# EAGLE design 2in-2out_1.0b (EAGLE 5.02)
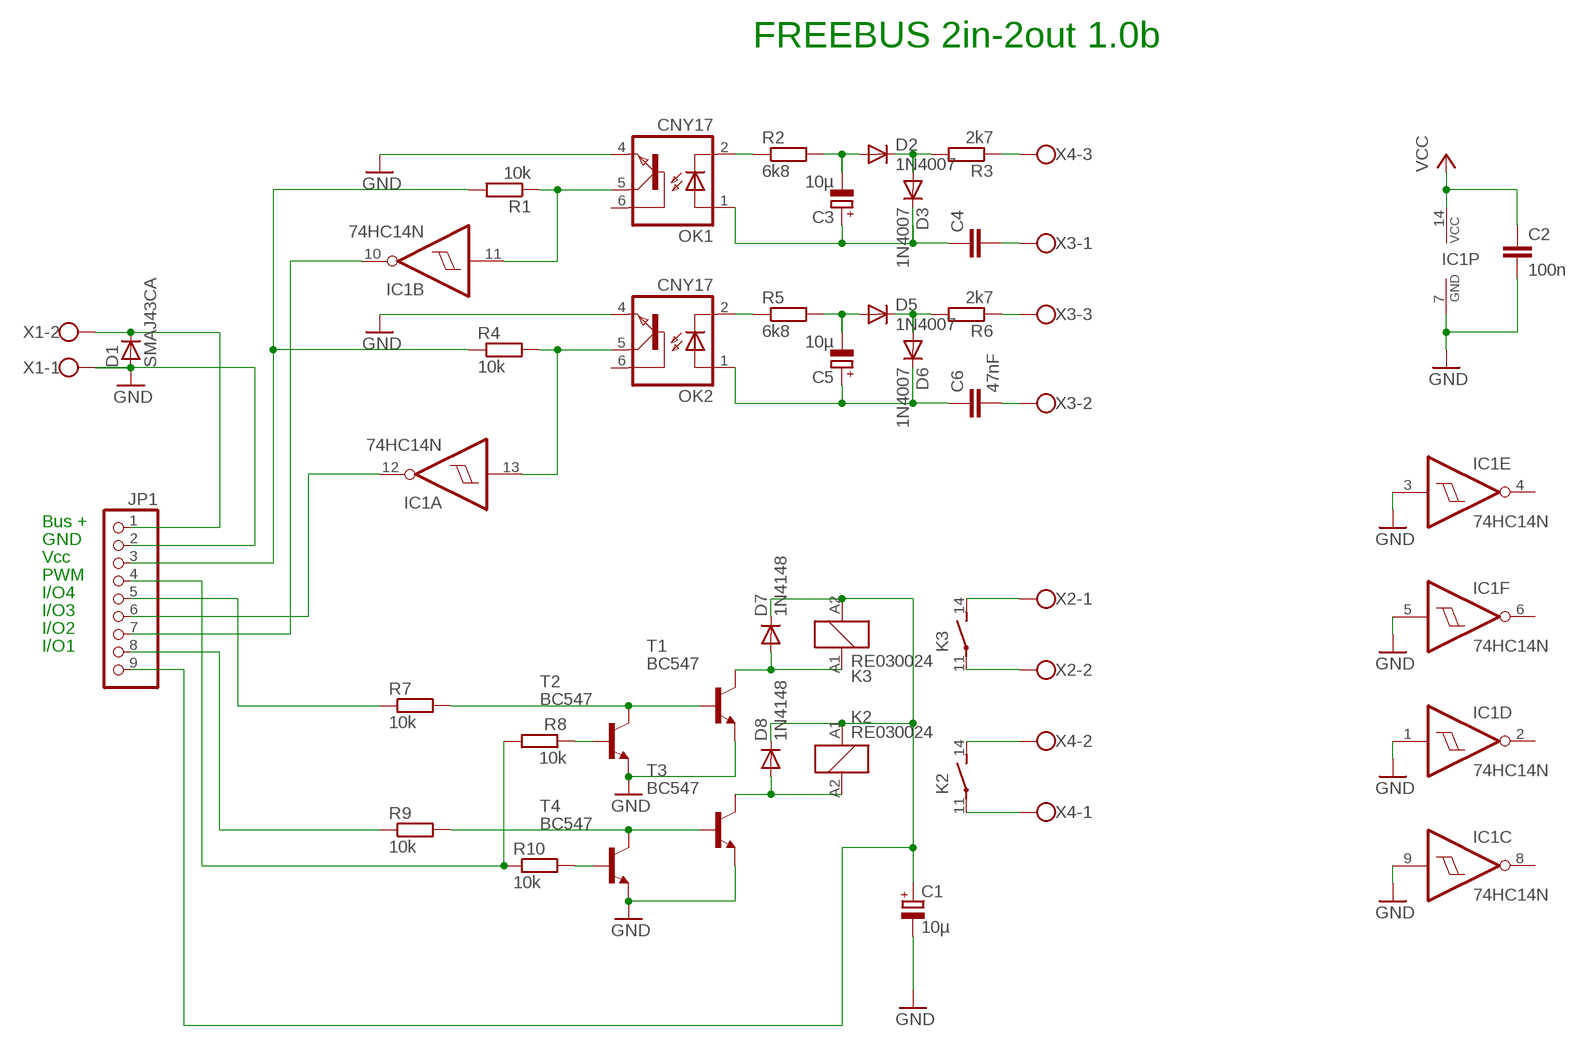
[diagram p0: schematic, sheet 1]

## Parts
C1  10µ  CPOL-EUE3.5-8  [E3,5-8]
C2  100n  C-EU025-024X044  [C025-024X044]
C3  10µ  CPOL-EUE2-4  [E2-4]
C4  C-EU075-063X106  [C075-063X106]
C5  10µ  CPOL-EUE2-4  [E2-4]
C6  47nF  C-EU075-063X106  [C075-063X106]
D1  SMAJ43CA  D-SMB  [SMB]
D2  1N4007  DIODE-D-2.5  [D-2.5]
D3  1N4007  DIODE-D-2.5  [D-2.5]
D5  1N4007  DIODE-D-2.5  [D-2.5]
D6  1N4007  DIODE-D-2.5  [D-2.5]
D7  1N4148  1N4148STEHEND  [D-2.5]
D8  1N4148  1N4148STEHEND  [D-2.5]
IC1  74HC14N  [DIL14]
JP1  PINHD-1X9  [1X09]
K2  RE030024  [RE-SCHRACK]
K3  RE030024  [RE-SCHRACK]
OK1  CNY17  [DIL06]
OK2  CNY17  [DIL06]
R1  10k  R-EU_0207/10  [0207/10]
R2  6k8  R-EU_0207/2V  [0207/2V]
R3  2k7  R-EU_0207/2V  [0207/2V]
R4  10k  R-EU_0207/2V  [0207/2V]
R5  6k8  R-EU_0207/2V  [0207/2V]
R6  2k7  R-EU_0207/2V  [0207/2V]
R7  10k  R-EU_0207/2V  [0207/2V]
R8  10k  R-EU_0207/2V  [0207/2V]
R9  10k  R-EU_0207/2V  [0207/2V]
R10  10k  R-EU_0204/7  [0204/7]
T1  BC547  [TO92]
T2  BC547  [TO92]
T3  BC547  [TO92]
T4  BC547  [TO92]
X1  W237-02P  [W237-132]
X2  W237-02P  [W237-132]
X3  W237-3E  [W237-3E]
X4  W237-3E  [W237-3E]

## Nets
GND: C1.- C2.2 D1.2(A) IC1.1(D:I) IC1.3(E:I) IC1.5(F:I) IC1.7(P:GND) IC1.9(C:I) JP1.2 OK1.4(EMI) OK2.4(EMI) T1.1(E) T2.1(E) T3.1(E) T4.1(E) X1.1
IO1: JP1.8 R9.1
IO2: IC1.10(B:O) JP1.7
IO3: IC1.12(A:O) JP1.6
IO4: JP1.5 R7.1
N$1: OK1.2(C) R2.1
N$2: K3.11(2:P) X2.2
N$3: C3.- D2.A R2.2
N$4: D1.1(C) JP1.1 X1.2
N$5: D2.C D3.A R3.2
N$6: K3.14(2:S) X2.1
N$8: K2.14(2:S) X4.2
N$9: K2.11(2:P) X4.1
N$10: OK2.2(C) R5.1
N$11: R6.1 X3.3
N$13: C5.- D5.A R5.2
N$14: R7.2 T1.2(B) T2.3(C)
N$15: C4.2 X3.1
N$17: R9.2 T3.2(B) T4.3(C)
N$18: D5.C D6.A R6.2
N$19: D8.A K2.A2 T3.3(C)
N$20: C5.+ C6.1 D6.C OK2.1(A)
N$21: R8.1 T2.2(B)
N$22: R10.2 T4.2(B)
N$23: C6.2 X3.2
N$24: C3.+ C4.1 D3.C OK1.1(A)
N$25: R3.1 X4.3
N$28: IC1.13(A:I) OK2.5(COL) R4.2
N$29: IC1.11(B:I) OK1.5(COL) R1.1
PWM: JP1.4 R8.2 R10.1
R3: D7.A K3.A1 T1.3(C)
VCC: C2.1 IC1.14(P:VCC) JP1.3 R1.2 R4.1
VDD_IN: C1.+ D7.C D8.C JP1.9 K2.A1 K3.A2
Unconnected: IC1.2(D:O) IC1.4(E:O) IC1.6(F:O) IC1.8(C:O) OK1.6(BAS) OK2.6(BAS)

## Notes on the sheet
- FREEBUS 2in-2out 1.0b
- Bus +
- GND
- Vcc
- PWM
- I/O4
- I/O3
- I/O2
- I/O1

## Library data of the parts
C1 C3 C5 = rcl:CPOL-EU: POLARIZED CAPACITOR, European symbol
C2 C4 C6 = rcl:C-EU: CAPACITOR, European symbol
D1 = semicon-smd-ipc:D-: DIODE unfilled
D2 D3 D5 D6 = diode:DIODE-: DIODE
D7 D8 = diode:1N4148: DIODE high speed (Philips)
IC1 = 74xx-eu:74*14: Hex schmitt trigger INVERTER
JP1 = pinhead:PINHD-1X9: PIN HEADER
K2 K3 = relay:RE03*: Miniature PCB Relay 1 pole 6 A SCHRACK Source: http://www.schrack.com/.. 5812.pdf
OK1 OK2 = optocoupler:CNY17: SIEMENS OPTO COUPLER
R1-R10 = rcl:R-EU_: RESISTOR, European symbol
T1-T4 = transistor-npn:BC547*: NPN Transistor
X1 X2 = con-wago-508:W237-02P: WAGO SREW CLAMP
X3 X4 = con-wago-508:W237-3E: WAGO SREW CLAMP

## Board
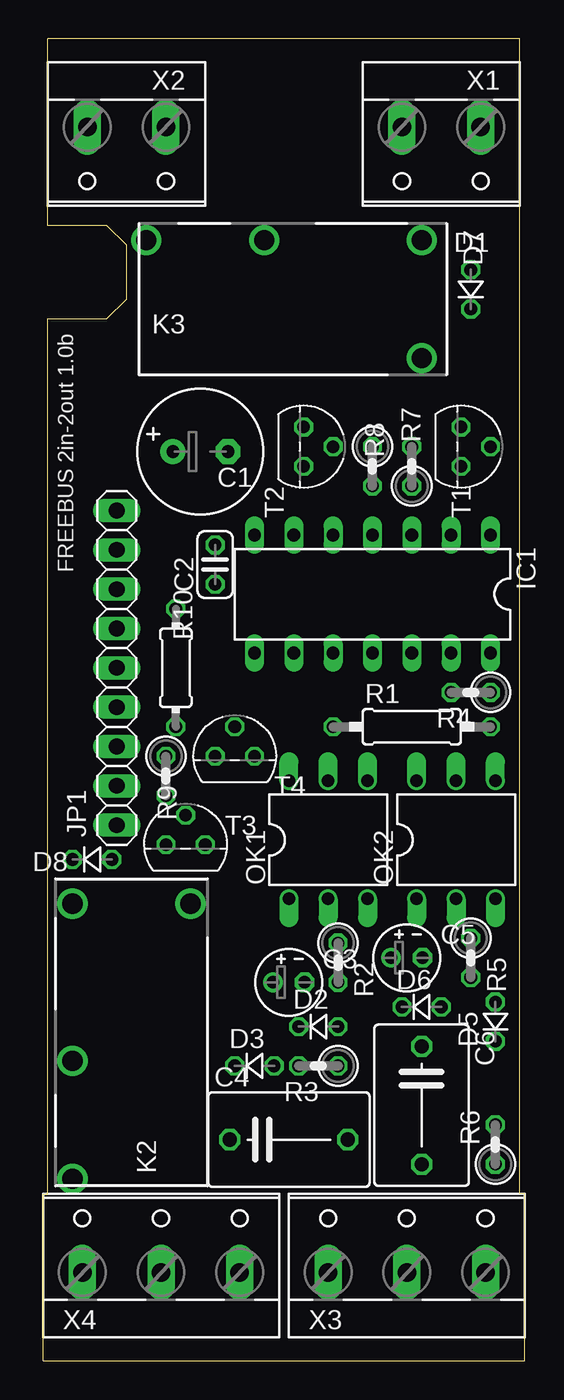
[diagram p1: board, top side]
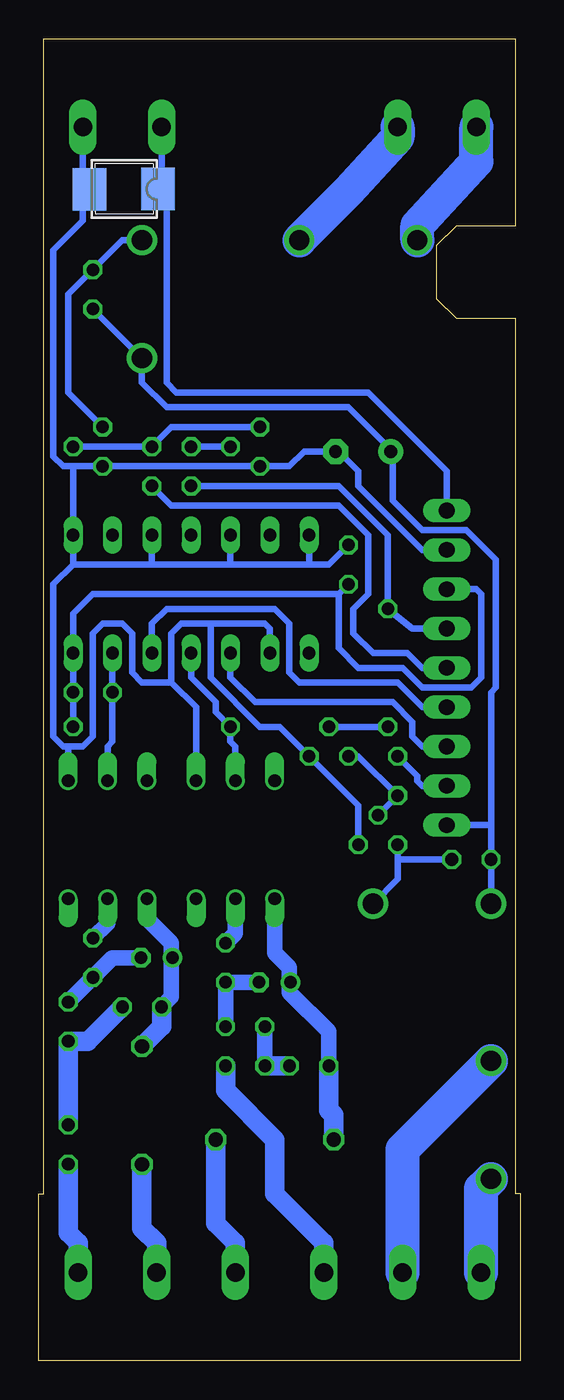
[diagram p2: board, bottom side, seen from below]

Size 31.11 x 85.41 mm. Coordinates in mm from the lower left corner, seen from the top.
Outline: 0,0 0,10.79 0.32,10.79 0.32,67.31 4.13,67.31 5.4,68.58 5.4,72.07 4.13,73.34 0.32,73.34 0.32,85.41 30.8,85.41 30.8,10.79 31.11,10.79 31.11,0 0,0
Copper layers (1*16): Top 0.035mm / dielectric 1.5mm / Bottom 0.035mm
Design rules "ZWILLING": minimum track width 0.2mm, minimum drill 0.5mm, track to track 0.2mm, track to pad 0.2mm, pad to pad 0.2mm, via to via 0.2mm, smd to smd 0mil, copper to edge 0.2mm, drill to drill 0.2mm, minimum pad ring 0.2mm, minimum via ring 0.2mm, stop-mask expansion 0.1mm, vias tented up to drill 0mil, thermal gap 10mil

### Footprints (pad centres in the part's own frame; a part is rotated, then mirrored left to right if it is on the bottom)
E3,5-8 = drill 0.813 pad 1.6 round: + -1.778,0 | drill 0.813 pad 1.6 octagon: - 1.778,0
C025-024X044 = drill 0.813 octagon: 1 -1.27,0; 2 1.27,0
E2-4 = drill 0.813 pad 1.27 round: + -1.016,0 | drill 0.813 pad 1.27 octagon: - 1.016,0
C075-063X106 = drill 0.914 octagon: 1 -3.81,0; 2 3.81,0
SMB = smd 2.159 x 2.743: 1 -2.311,-0.127; 2 2.108,-0.102
D-2.5 = drill 0.813 octagon: A 1.27,0; C -1.27,0
DIL14 = drill 0.813 long: 1 -7.62,-3.81; 2 -5.08,-3.81; 3 -2.54,-3.81; 4 0,-3.81; 5 2.54,-3.81; 6 5.08,-3.81; 7 7.62,-3.81; 8 7.62,3.81; 9 5.08,3.81; 10 2.54,3.81; 11 0,3.81; 12 -2.54,3.81; 13 -5.08,3.81; 14 -7.62,3.81
1X09 = drill 1.016 long: 1 -10.16,0; 2 -7.62,0; 3 -5.08,0; 4 -2.54,0; 5 0,0; 6 2.54,0; 7 5.08,0; 8 7.62,0; 9 10.16,0
RE-SCHRACK = drill 1.3 round: 11 8.89,-3.81; 14 1.27,-3.81; A1 -8.89,-3.81; A2 -8.89,3.81
DIL06 = drill 0.813 offset: 1 -2.54,-3.81; 2 0,-3.81; 3 2.54,-3.81; 4 2.54,3.81; 5 0,3.81; 6 -2.54,3.81
0207/10 = drill 0.813 octagon: 1 -5.08,0; 2 5.08,0
0207/2V = drill 0.813 octagon: 1 -1.27,0; 2 1.27,0
0204/7 = drill 0.813 octagon: 1 -3.81,0; 2 3.81,0
TO92 = drill 0.813 octagon: 1 1.27,0; 2 0,1.905; 3 -1.27,0
W237-132 = drill 1.194 long: 1 -2.54,-0.635; 2 2.54,-0.635
W237-3E = drill 1.194 long: 1 -5.08,-0.635; 2 0,-0.635; 3 5.08,-0.635

### Placement (x,y rotation side)
C1  10.16,58.74 0 top
C2  11.11,51.44 90 top
C3  15.88,24.45 0 top
C4  15.88,14.29 0 top
C5  23.49,26.04 0 top
C6  24.45,16.51 270 top
D1  25.72,75.56 180 bottom
D2  17.78,21.59 0 top
D3  13.65,19.05 0 top
D5  29.21,21.91 90 top
D6  24.45,22.86 0 top
D7  27.62,69.22 90 top
D8  3.17,32.38 0 top
IC1  21.27,49.53 180 top
JP1  4.76,44.77 270 top
K2  5.71,20.64 270 top
K3  15.56,68.58 180 top
OK1  18.41,33.66 0 top
OK2  26.67,33.66 0 top
R1  23.81,40.96 0 top
R2  19.05,25.72 270 top
R3  17.78,19.05 180 top
R4  27.62,43.18 180 top
R5  27.62,26.04 270 top
R6  29.21,13.97 90 top
R7  23.81,57.79 90 top
R8  21.27,57.79 270 top
R9  7.94,37.78 270 top
R10  8.57,44.77 270 top
T1  26.99,59.05 270 top
T2  16.83,59.05 270 top
T3  9.21,33.34 0 top
T4  12.38,39.05 0 top
X1  25.72,79.06 180 top
X2  5.4,79.06 180 top
X3  23.49,6.35 0 top
X4  7.62,6.35 0 top

### Tracks (layer width: path | path; a pad name or v marks a point on that pad's centre or on a via)
GND
  Bottom 0.305: 28.26,75.67 D1.2
  Bottom 0.406: T3.1 10.48,35.88 T4.1 15.56,40.96 16.83,40.96 20,44.13 20,47.62 | 28.89,57.79 T1.1 T2.1 14.92,57.79 13.97,58.74 11.75,58.74 | 29.21,39.69 29.53,39.69 30.16,40.32 30.16,50.16 28.89,51.44 | 28.89,57.79 29.53,57.79 30.16,58.42 30.16,71.75 28.26,73.66 28.26,75.67 X1.1 | 11.75,58.74 C1.- | 11.75,58.74 10.48,57.47 10.48,56.52 6.35,52.39 JP1.2 | 20,47.62 21.91,47.62 22.54,46.99 22.54,43.82 | 22.54,43.82 24.45,43.82 25.08,44.45 25.08,46.99 25.72,47.62 26.99,47.62 27.62,46.99 27.62,40.32 28.26,39.69 29.21,39.69 | 29.21,39.69 OK2.4 | OK1.4 20.95,42.23 22.54,43.82 | 13.65,51.44 IC1.7 | 28.89,51.44 23.81,51.44 | 23.81,51.44 18.73,51.44 | 18.73,51.44 13.65,51.44 | 18.73,51.44 IC1.5 | 23.81,51.44 IC1.3 | 28.89,51.44 IC1.1 28.89,57.79 | IC1.9 16.19,47.31 16.51,47.62 20,47.62 | 13.65,51.44 12.38,51.44 C2.2
IO1
  Bottom 0.406: R9.1 6.67,37.78 6.67,37.47 6.35,37.15 JP1.8
IO2
  Bottom 0.406: IC1.10 18.73,44.13 17.15,42.55 8.26,42.55 6.99,41.28 6.99,40.32 6.35,39.69 JP1.7
IO3
  Bottom 0.406: IC1.12 23.81,47.62 22.86,48.58 15.87,48.58 14.92,47.62 14.92,44.45 14.29,43.82 7.94,43.82 6.35,42.23 JP1.6
IO4
  Bottom 0.406: JP1.5 6.35,44.77 7.3,45.72 9.52,45.72 10.79,46.99 10.79,48.58 9.84,49.53 9.84,53.34 11.75,55.25 22.54,55.25 R7.1
N$1
  Bottom 1.016: R2.1 18.42,27.62 OK1.2
N$2
  Bottom 2.184: K3.11 6.67,73.34 2.86,77.47 X2.2
N$3
  Bottom 1.016: D2.A R2.2 C3.- 16.83,24.45
N$4
  Bottom 0.305: 22.86,76.01 23.18,76.2 D1.1
  Bottom 0.406: 22.86,76.01 22.86,63.18 22.22,62.55 9.84,62.55 4.76,57.47 JP1.1 | 23.18,76.2 X1.2
N$5
  Bottom 1.016: R3.2 D2.C
  Bottom 1.27: D3.A R3.2
N$6
  Bottom 2.184: K3.14 11.11,75.56 7.94,79.06 X2.1
N$8
  Bottom 2.184: K2.14 7.62,13.65 X4.2
N$9
  Bottom 2.184: K2.11 2.54,11.11 X4.1
N$10
  Bottom 1.016: R5.1 26.67,28.26 OK2.2
N$11
  Bottom 1.27: X3.3 28.58,7.62 29.21,8.26 R6.1
N$13
  Bottom 1.016: C5.- 26.35,26.04 R5.2 D5.A
N$14
  Bottom 0.406: T1.2 R7.2 22.54,60.33 T2.3
N$15
  Bottom 1.27: X3.1 18.42,7.62 19.68,8.89 C4.2
N$17
  Bottom 0.406: T3.2 R9.2 10.48,39.05 T4.3
N$18
  Bottom 1.27: D6.A 27.94,20.64 D5.C R6.2
N$19
  Bottom 0.406: 7.94,32.38 7.94,31.11 K2.A2 | D8.A 7.94,32.38 | 7.94,32.38 T3.3
N$20
  Bottom 1.016: D6.C 22.54,23.49 22.54,25.72 | 22.54,25.72 C5.+ | 22.54,25.72 22.54,26.99 24.13,28.57 OK2.1
  Bottom 1.27: C6.1 23.18,21.59 D6.C
N$21
  Bottom 0.406: T2.2 R8.1
N$22
  Bottom 0.406: R10.2 T4.2
N$23
  Bottom 1.27: X3.2 23.49,7.62 24.45,8.57 C6.2
N$24
  Bottom 1.016: D3.C 12.38,21.27 14.92,23.81 14.92,24.45 | 14.92,24.45 C3.+ | 14.92,24.45 14.92,25.4 15.87,26.35 OK1.1
  Bottom 1.27: C4.1 12.07,15.88 12.38,16.19 D3.C
N$25
  Bottom 1.27: X4.3 12.7,7.62 15.87,10.79 15.87,14.29 19.05,17.46 R3.1
N$28
  Bottom 0.406: OK2.5 26.67,39.69 26.35,40.01 R4.2 IC1.13
N$29
  Bottom 0.406: OK1.5 18.42,39.69 18.73,40.01 R1.1 19.68,41.91 19.68,42.55 21.27,44.13 IC1.11
PWM
  Bottom 0.406: JP1.4 6.99,47.31 R10.1 8.57,53.34 11.75,56.52 R8.2
R3
  Bottom 0.406: T1.3 29.21,62.55 29.21,68.9 D7.A 25.72,72.39 K3.A1
VCC
  Bottom 0.406: 11.75,49.53 11.75,46.04 10.48,44.77 7.62,44.77 6.35,43.5 3.17,43.5 2.54,44.13 2.54,49.53 2.86,49.85 JP1.3 | 11.75,49.53 27.62,49.53 28.89,48.26 IC1.14 R4.1 R1.2 | 11.75,49.53 C2.1
VDD_IN
  Bottom 0.406: K2.A1 D8.C 1.9,34.61 | 1.9,34.61 JP1.9 | 8.26,58.74 8.26,55.56 6.35,53.66 3.49,53.66 1.59,51.75 1.59,43.5 1.9,43.18 1.9,34.61 | 8.26,58.74 C1.+ | 8.26,58.74 11.11,61.59 22.86,61.59 24.45,63.18 K3.A2 D7.C

### Text on the board
tNames: FREEBUS 2in-2out 1.0b